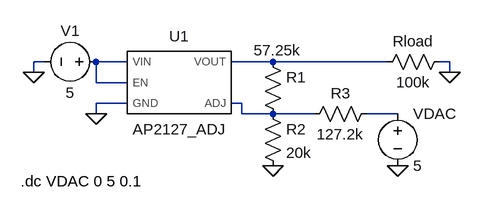
[diagram p0: schematic vreg_pulling.asc]
vreg_pulling.asc, the LTspice schematic file:
Version 4
SHEET 1 880 680
WIRE -80 112 -96 112
WIRE 48 112 0 112
WIRE 272 112 208 112
WIRE 448 112 272 112
WIRE 544 112 528 112
WIRE -96 128 -96 112
WIRE 544 128 544 112
WIRE 0 144 0 112
WIRE 48 144 0 144
WIRE 48 176 0 176
WIRE 224 176 208 176
WIRE 0 192 0 176
WIRE 224 192 224 176
WIRE 272 192 224 192
WIRE 336 192 272 192
WIRE 464 192 416 192
FLAG -96 128 0
FLAG 0 192 0
FLAG 544 128 0
FLAG 272 272 0
FLAG 464 272 0
SYMBOL AutoGenerated\\AP2127_ADJ 128 144 R0
SYMATTR InstName U1
SYMBOL voltage 16 112 R90
WINDOW 0 -32 56 VBottom 2
WINDOW 3 32 56 VTop 2
SYMATTR InstName V1
SYMATTR Value 5
SYMBOL res 544 96 R90
WINDOW 0 0 56 VBottom 2
WINDOW 3 32 56 VTop 2
SYMATTR InstName Rload
SYMATTR Value 100k
SYMBOL res 256 96 R0
WINDOW 3 59 -2 Right 2
SYMATTR InstName R1
SYMATTR Value 57.25k
SYMBOL res 256 176 R0
SYMATTR InstName R2
SYMATTR Value 20k
SYMBOL res 432 176 R90
WINDOW 0 0 56 VBottom 2
WINDOW 3 32 56 VTop 2
SYMATTR InstName R3
SYMATTR Value 127.2k
SYMBOL voltage 464 176 R0
SYMATTR InstName VDAC
SYMATTR Value 5
TEXT -116 296 Left 2 !.dc VDAC 0 5 0.1

The netlist it stands for:
* vreg_pulling.asc
XU1 N001 0 N001 N003 N002 AP2127_ADJ  ; pins VIN GND EN ADJ VOUT
V1 N001 0 5
Rload 0 N002 100k
R1 N002 N003 57.25k
R2 N003 0 20k
R3 N004 N003 127.2k
VDAC N004 0 5
.dc VDAC 0 5 0.1
.lib Z:\home\ktemkin\Projects\foxglove\simulation\ap2127.txt
.backanno
.end